# Altium schematic sheet 0029_System_debug_conne.SchDoc
size A3
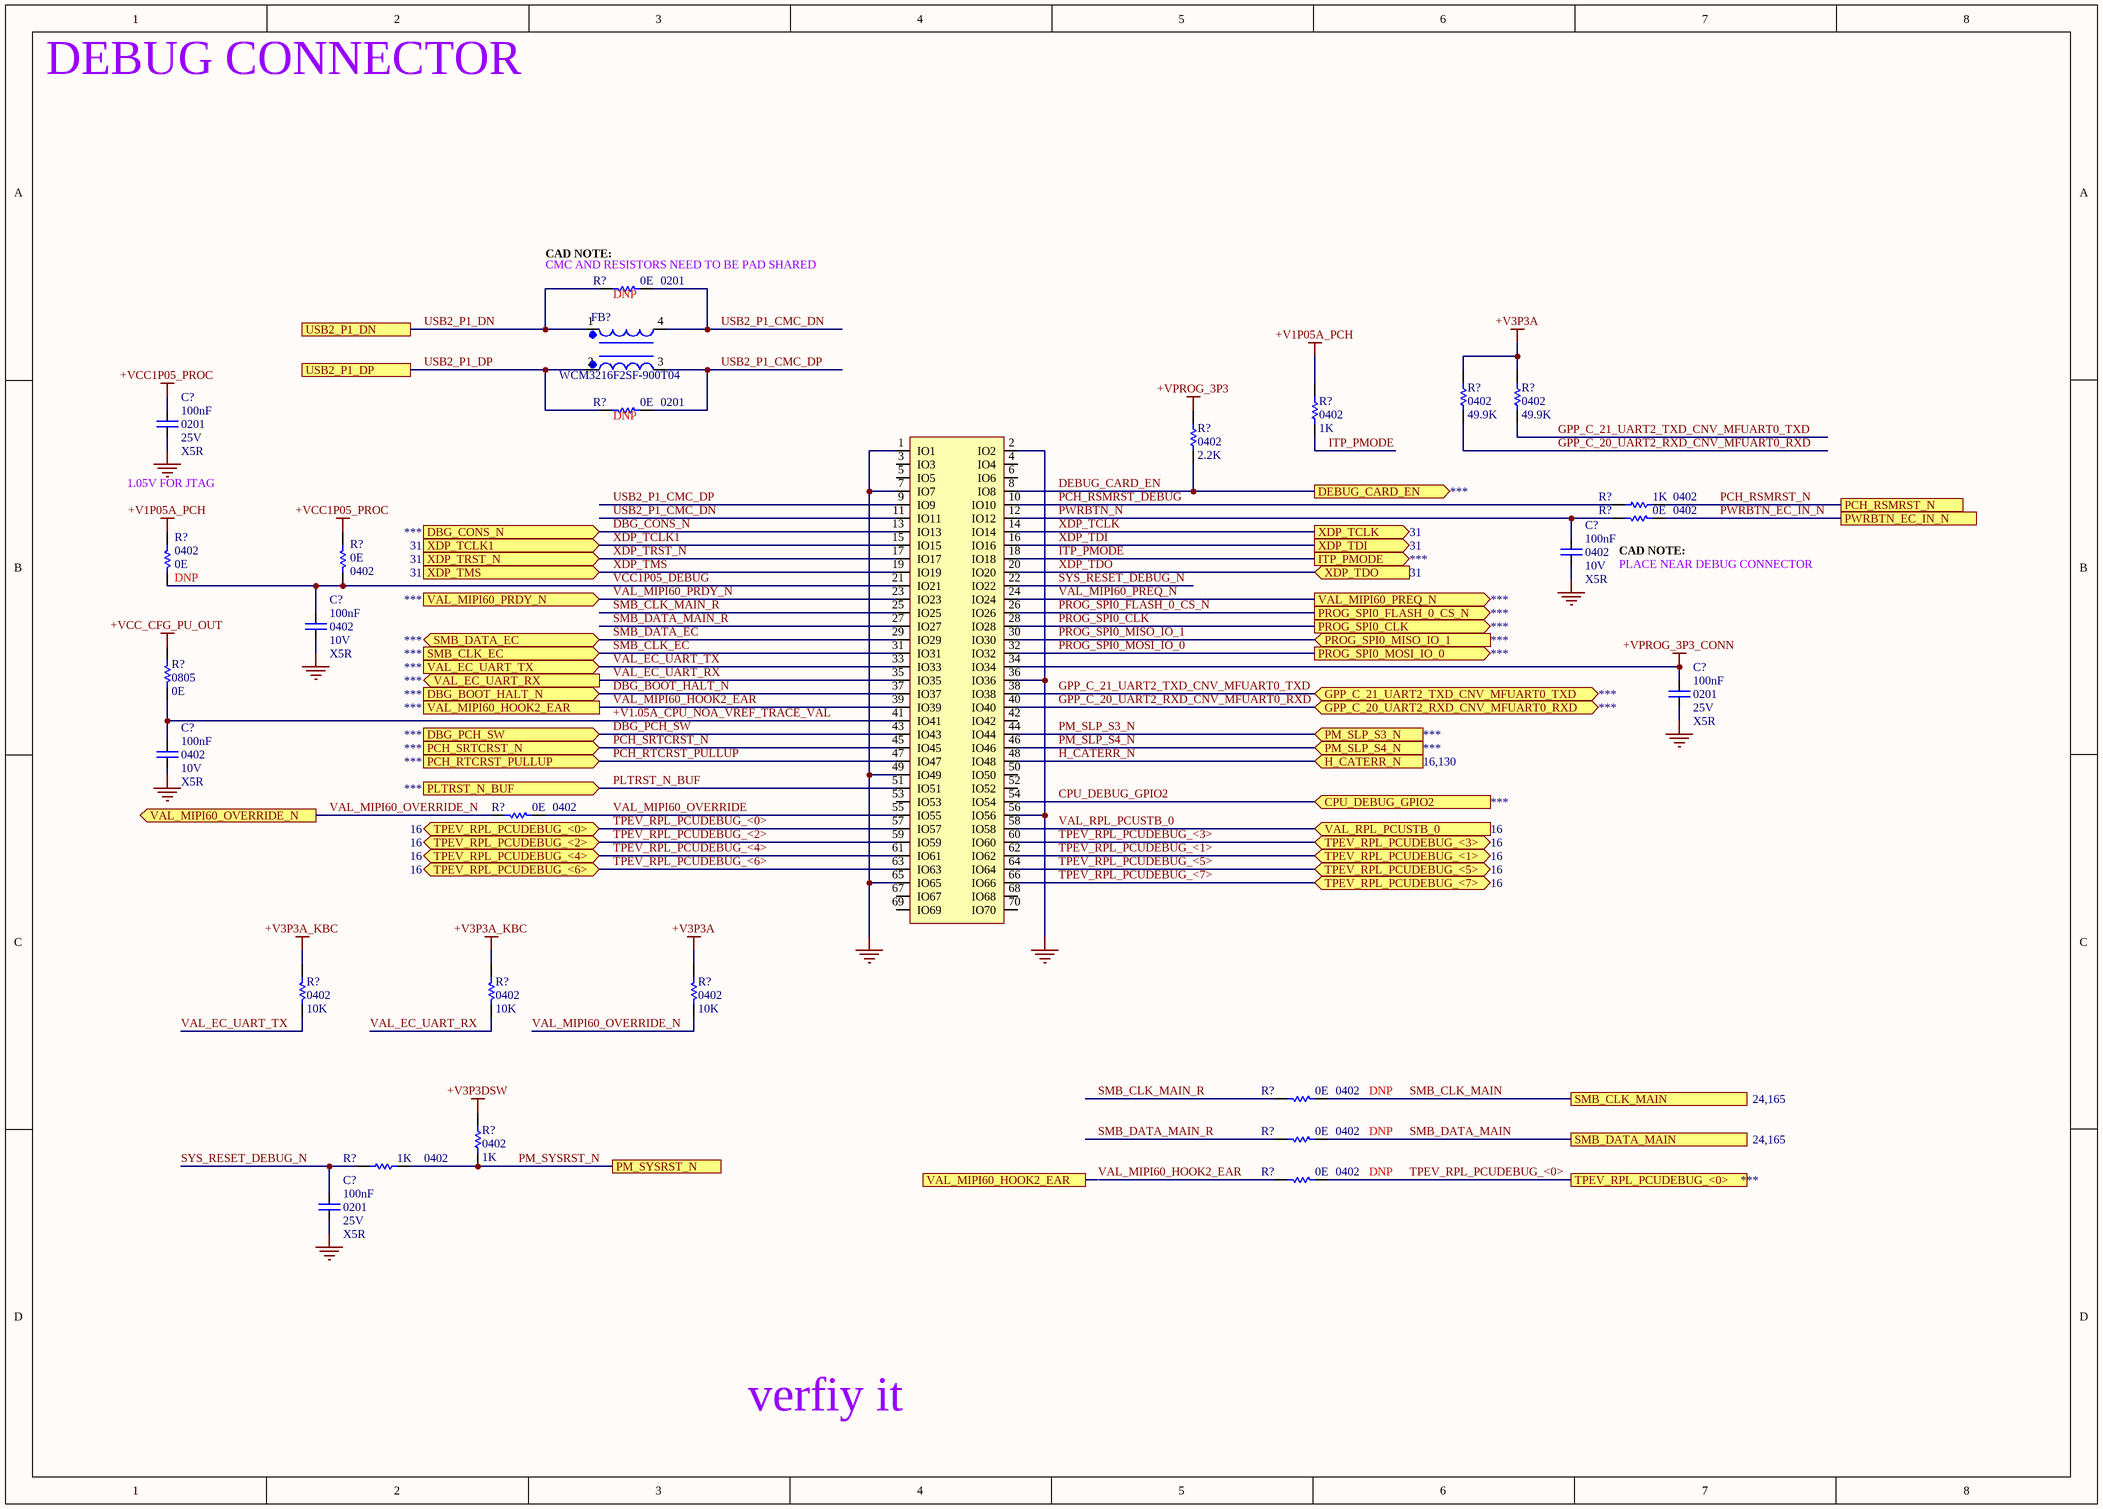
[diagram p0: 0029_System_debug_conne.SchDoc]

## Parts
(Parts that share a designator on the sheet are numbered #1, #2 ... from top to bottom, then left to right.)
C?#1  value 100nF  Case/Package: 0201  Voltage: 25V  Dielectric: X5R  [CAPC0201]
C?#2  value 100nF  Case/Package: 0402  Voltage: 10V  Dielectric: X5R  [CAPC0402]
C?#3  value 100nF  Case/Package: 0402  Voltage: 10V  Dielectric: X5R  [CAPC0402]
C?#4  value 100nF  Case/Package: 0201  Voltage: 25V  Dielectric: X5R  [CAPC0201]
C?#5  value 100nF  Case/Package: 0402  Voltage: 10V  Dielectric: X5R  [CAPC0402]
C?#6  value 100nF  Case/Package: 0201  Voltage: 25V  Dielectric: X5R  [CAPC0201]
FB?  WCM3216F2SF-900T04  [CHOKE]
J?  C_B2B_2X35  (value not drawn)
R?#1  value 0E  Case/Package: 0201  [RESC0201]  (hidden comment: Res)
R?#2  value 49.9K  Case/Package: 0402  [RESC0402]  (hidden comment: Res)
R?#3  value 49.9K  Case/Package: 0402  [RESC0402]  (hidden comment: Res)
R?#4  value 0E  Case/Package: 0201  [RESC0201]  (hidden comment: Res)
R?#5  value 1K  Case/Package: 0402  [RESC0402]  (hidden comment: Res)
R?#6  value 2.2K  Case/Package: 0402  [RESC0402]  (hidden comment: Res)
R?#7  value 1K  Case/Package: 0402  [RESC0402]  (hidden comment: Res)
R?#8  value 0E  Case/Package: 0402  [RESC0402]  (hidden comment: Res)
R?#9  value 0E  Case/Package: 0402  [RESC0402]  (hidden comment: Res)
R?#10  value 0E  Case/Package: 0402  [RESC0402]  (hidden comment: Res)
R?#11  value 0E  Case/Package: 0805  [RESC0805]  (hidden comment: Res)
R?#12  value 0E  Case/Package: 0402  [RESC0402]  (hidden comment: Res)
R?#13  value 10K  Case/Package: 0402  [RESC0402]  (hidden comment: Res)
R?#14  value 10K  Case/Package: 0402  [RESC0402]  (hidden comment: Res)
R?#15  value 10K  Case/Package: 0402  [RESC0402]  (hidden comment: Res)
R?#16  value 0E  Case/Package: 0402  [RESC0402]  (hidden comment: Res)
R?#17  value 1K  Case/Package: 0402  [RESC0402]  (hidden comment: Res)
R?#18  value 0E  Case/Package: 0402  [RESC0402]  (hidden comment: Res)
R?#19  value 1K  Case/Package: 0402  [RESC0402]  (hidden comment: Res)
R?#20  value 0E  Case/Package: 0402  [RESC0402]  (hidden comment: Res)

## Ports
CPU_DEBUG_GPIO2 (in), DBG_BOOT_HALT_N (in), DBG_CONS_N (in), DBG_PCH_SW (in), DEBUG_CARD_EN (out), GPP_C_20_UART2_RXD_CNV_MFUART0_RXD (bidir), GPP_C_21_UART2_TXD_CNV_MFUART0_TXD (bidir), H_CATERR_N (in), ITP_PMODE (out), PCH_RSMRST_N, PCH_RTCRST_PULLUP (in), PCH_SRTCRST_N (in), PLTRST_N_BUF (in), PM_SLP_S3_N (in), PM_SLP_S4_N (in), PM_SYSRST_N, PROG_SPI0_CLK (out), PROG_SPI0_FLASH_0_CS_N (out), PROG_SPI0_MISO_IO_1 (in), PROG_SPI0_MOSI_IO_0 (out), PWRBTN_EC_IN_N, SMB_CLK_EC (in), SMB_CLK_MAIN, SMB_DATA_EC (bidir), SMB_DATA_MAIN, TPEV_RPL_PCUDEBUG_<0>, TPEV_RPL_PCUDEBUG_<0> (bidir), TPEV_RPL_PCUDEBUG_<1> (bidir), TPEV_RPL_PCUDEBUG_<2> (bidir), TPEV_RPL_PCUDEBUG_<3> (bidir), TPEV_RPL_PCUDEBUG_<4> (bidir), TPEV_RPL_PCUDEBUG_<5> (bidir), TPEV_RPL_PCUDEBUG_<6> (bidir), TPEV_RPL_PCUDEBUG_<7> (bidir), USB2_P1_DN, USB2_P1_DP, VAL_EC_UART_RX (out), VAL_EC_UART_TX (in), VAL_MIPI60_HOOK2_EAR, VAL_MIPI60_OVERRIDE_N (out), VAL_MIPI60_PRDY_N (in), VAL_MIPI60_PREQ_N (out), VAL_RPL_PCUSTB_0 (in), XDP_TCLK1 (in), XDP_TCLK (out), XDP_TDI (out), XDP_TDO (in), XDP_TMS (in), XDP_TRST_N (in)

## Nets
+V1P05A_PCH: R?#5.2 R?#9.1
+V3P3A: R?#2.2 R?#3.2 R?#15.2
+V3P3A_KBC: R?#13.2 R?#14.2
+V3P3DSW: R?#17.2
+VCC1P05_PROC: C?#1.1 R?#10.1
+VCC_CFG_PU_OUT: R?#11.2
+VPROG_3P3: R?#6.2
+VPROG_3P3_CONN: C?#4.1 J?.34(IO34)
GND: C?#1.2 C?#2.2 C?#3.2 C?#4.2 C?#5.2 C?#6.2 J?.1(IO1) J?.2(IO2) J?.7(IO7) J?.36(IO36) J?.49(IO49) J?.56(IO56) J?.65(IO65)
+V1.05A_CPU_NOA_VREF_TRACE_VAL: C?#5.1 J?.41(IO41) R?#11.1
CPU_DEBUG_GPIO2: J?.54(IO54) ; port CPU_DEBUG_GPIO2
DBG_BOOT_HALT_N: J?.37(IO37) ; port DBG_BOOT_HALT_N
DBG_CONS_N: J?.13(IO13) ; port DBG_CONS_N
DBG_PCH_SW: J?.43(IO43) ; port DBG_PCH_SW
DEBUG_CARD_EN: J?.8(IO8) R?#6.1 ; port DEBUG_CARD_EN
GPP_C_20_UART2_RXD_CNV_MFUART0_RXD: J?.40(IO40) R?#2.1 ; port GPP_C_20_UART2_RXD_CNV_MFUART0_RXD
GPP_C_21_UART2_TXD_CNV_MFUART0_TXD: J?.38(IO38) R?#3.1 ; port GPP_C_21_UART2_TXD_CNV_MFUART0_TXD
H_CATERR_N: J?.48(IO48) ; port H_CATERR_N
ITP_PMODE: J?.18(IO18) R?#5.1 ; port ITP_PMODE
PCH_RSMRST_DEBUG: J?.10(IO10) R?#7.2
PCH_RSMRST_N: R?#7.1 ; port PCH_RSMRST_N
PCH_RTCRST_PULLUP: J?.47(IO47) ; port PCH_RTCRST_PULLUP
PCH_SRTCRST_N: J?.45(IO45) ; port PCH_SRTCRST_N
PLTRST_N_BUF: J?.51(IO51) ; port PLTRST_N_BUF
PM_SLP_S3_N: J?.44(IO44) ; port PM_SLP_S3_N
PM_SLP_S4_N: J?.46(IO46) ; port PM_SLP_S4_N
PM_SYSRST_N: R?#17.1 R?#19.1 ; port PM_SYSRST_N
PROG_SPI0_CLK: J?.28(IO28) ; port PROG_SPI0_CLK
PROG_SPI0_FLASH_0_CS_N: J?.26(IO26) ; port PROG_SPI0_FLASH_0_CS_N
PROG_SPI0_MISO_IO_1: J?.30(IO30) ; port PROG_SPI0_MISO_IO_1
PROG_SPI0_MOSI_IO_0: J?.32(IO32) ; port PROG_SPI0_MOSI_IO_0
PWRBTN_EC_IN_N: R?#8.2 ; port PWRBTN_EC_IN_N
PWRBTN_N: C?#2.1 J?.12(IO12) R?#8.1
SMB_CLK_EC: J?.31(IO31) ; port SMB_CLK_EC
SMB_CLK_MAIN: R?#16.2 ; port SMB_CLK_MAIN
SMB_CLK_MAIN_R: J?.25(IO25) R?#16.1
SMB_DATA_EC: J?.29(IO29) ; port SMB_DATA_EC
SMB_DATA_MAIN: R?#18.2 ; port SMB_DATA_MAIN
SMB_DATA_MAIN_R: J?.27(IO27) R?#18.1
SYS_RESET_DEBUG_N: C?#6.1 J?.22(IO22) R?#19.2
TPEV_RPL_PCUDEBUG_<0>: J?.57(IO57) R?#20.2 ; port TPEV_RPL_PCUDEBUG_<0>
TPEV_RPL_PCUDEBUG_<1>: J?.62(IO62) ; port TPEV_RPL_PCUDEBUG_<1>
TPEV_RPL_PCUDEBUG_<2>: J?.59(IO59) ; port TPEV_RPL_PCUDEBUG_<2>
TPEV_RPL_PCUDEBUG_<3>: J?.60(IO60) ; port TPEV_RPL_PCUDEBUG_<3>
TPEV_RPL_PCUDEBUG_<4>: J?.61(IO61) ; port TPEV_RPL_PCUDEBUG_<4>
TPEV_RPL_PCUDEBUG_<5>: J?.64(IO64) ; port TPEV_RPL_PCUDEBUG_<5>
TPEV_RPL_PCUDEBUG_<6>: J?.63(IO63) ; port TPEV_RPL_PCUDEBUG_<6>
TPEV_RPL_PCUDEBUG_<7>: J?.66(IO66) ; port TPEV_RPL_PCUDEBUG_<7>
USB2_P1_CMC_DN: FB?.4 J?.11(IO11) R?#1.2
USB2_P1_CMC_DP: FB?.3 J?.9(IO9) R?#4.2
USB2_P1_DN: FB?.1 R?#1.1 ; port USB2_P1_DN
USB2_P1_DP: FB?.2 R?#4.1 ; port USB2_P1_DP
VAL_EC_UART_RX: J?.35(IO35) R?#14.1 ; port VAL_EC_UART_RX
VAL_EC_UART_TX: J?.33(IO33) R?#13.1 ; port VAL_EC_UART_TX
VAL_MIPI60_HOOK2_EAR: J?.39(IO39) ; port VAL_MIPI60_HOOK2_EAR
VAL_MIPI60_OVERRIDE: J?.55(IO55) R?#12.2
VAL_MIPI60_OVERRIDE_N: R?#12.1 R?#15.1 ; port VAL_MIPI60_OVERRIDE_N
VAL_MIPI60_PRDY_N: J?.23(IO23) ; port VAL_MIPI60_PRDY_N
VAL_MIPI60_PREQ_N: J?.24(IO24) ; port VAL_MIPI60_PREQ_N
VAL_RPL_PCUSTB_0: J?.58(IO58) ; port VAL_RPL_PCUSTB_0
VCC1P05_DEBUG: C?#3.1 J?.21(IO21) R?#9.2 R?#10.2
XDP_TCLK: J?.14(IO14) ; port XDP_TCLK
XDP_TCLK1: J?.15(IO15) ; port XDP_TCLK1
XDP_TDI: J?.16(IO16) ; port XDP_TDI
XDP_TDO: J?.20(IO20) ; port XDP_TDO
XDP_TMS: J?.19(IO19) ; port XDP_TMS
XDP_TRST_N: J?.17(IO17) ; port XDP_TRST_N

Not connected (* = marked no-connect by the designer): J? 3(IO3) 4(IO4) 5(IO5) 6(IO6) 42(IO42) 50(IO50) 52(IO52) 53(IO53) 67(IO67) 68(IO68) 69(IO69) 70(IO70); R?#20 1

## Notes on the sheet
- DEBUG CONNECTOR
- (near R?#1) CAD NOTE:
- (near R?#1) CMC AND RESISTORS NEED TO BE PAD SHARED
- 1.05V FOR JTAG
- (near R?#8) CAD NOTE:
- PLACE NEAR DEBUG CONNECTOR
- verfiy it

## Library data of the parts
C?#1 C?#4 C?#6 = Cap: CAP CER 100nF 25V X5R 0201
C?#2 C?#3 C?#5 = Cap: CAP CER 100nF 10V X5R 0402
FB? = WCM3216F2SF-900T04: Power, Signal Line 90 Ohms @ 100MHz 300 mOhm 50V SMD,3.2x1.6x2mm Common Mode Filters RoHS; Manufacturer Part Number: WCM3216F2SF-900T04; Case/Package: 3.2x1.6x2mm
R?#1 R?#4 = Res: Thick Film Resistor -  0ohm, 1%, 0201; DNP: DNP
R?#2 R?#3 = Res: Thick Film Resistor -  49.9Kohm, 1%, 0402
R?#5 R?#7 R?#17 R?#19 = Res: Thick Film Resistor -  1Kohm, 1%, 0402
R?#6 = Res: Thick Film Resistor -  2.2Kohm, 1%, 0402
R?#8-R?#10 R?#12 R?#16 R?#18 R?#20 = Res: Thick Film Resistor -  0ohm, 1%, 0402
  R?#9 R?#16 R?#18 R?#20: DNP: DNP
R?#11 = Res: Thick Film Resistor -  0ohm, 1%, 0805
R?#13-R?#15 = Res: Thick Film Resistor -  10Kohm, 1%, 0402
J? = C_B2B_2X35: Manufacturer Part Number: *; Case/Package: *